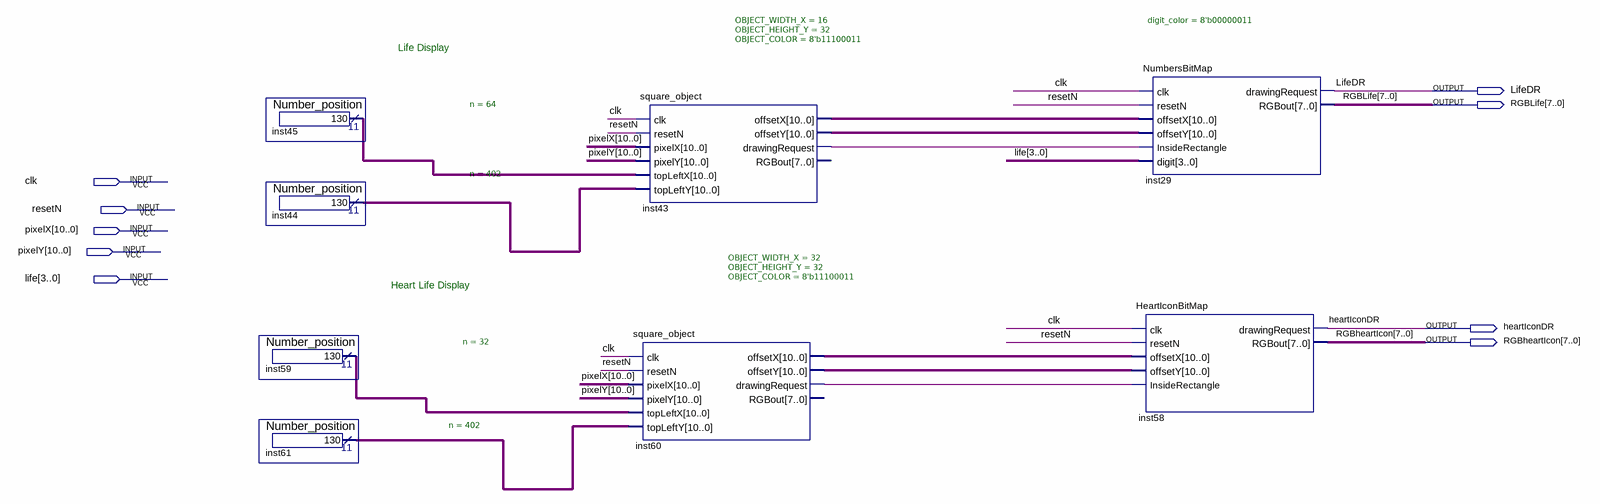
[diagram p0: schematic sheet]
// Quartus schematic Life_Block.bdf as structural Verilog: 8 symbols, 9 pins
module Life_Block (
  input  clk,
  input  resetN,
  input  [10:0] pixelX,
  input  [10:0] pixelY,
  input  [3:0] life,
  output LifeDR,
  output [7:0] RGBLife,
  output heartIconDR,
  output [7:0] RGBheartIcon
);

  wire inst43_drawingrequest, inst60_drawingrequest;
  wire [10:0] inst43_offsetx, inst43_offsety, inst44_result, inst45_result, inst59_result, inst60_offsetx,
       inst60_offsety, inst61_result;

  Number_position #(.n(64)) inst45 (.result(inst45_result));
  Number_position #(.n(402)) inst44 (.result(inst44_result));
  Number_position #(.n(32)) inst59 (.result(inst59_result));
  Number_position #(.n(402)) inst61 (.result(inst61_result));
  square_object #(.OBJECT_WIDTH_X(16), .OBJECT_HEIGHT_Y(32), .OBJECT_COLOR(8'b11100011)) inst43 (
    .clk(clk), .resetN(resetN), .pixelX(pixelX), .pixelY(pixelY), .topLeftX(inst45_result),
    .topLeftY(inst44_result), .offsetX(inst43_offsetx), .offsetY(inst43_offsety),
    .drawingRequest(inst43_drawingrequest));  // open: RGBout
  square_object #(.OBJECT_WIDTH_X(32), .OBJECT_HEIGHT_Y(32), .OBJECT_COLOR(8'b11100011)) inst60 (
    .clk(clk), .resetN(resetN), .pixelX(pixelX), .pixelY(pixelY), .topLeftX(inst59_result),
    .topLeftY(inst61_result), .offsetX(inst60_offsetx), .offsetY(inst60_offsety),
    .drawingRequest(inst60_drawingrequest));  // open: RGBout
  NumbersBitMap #(.digit_color(8'b00000011)) inst29 (
    .clk(clk), .resetN(resetN), .offsetX(inst43_offsetx), .offsetY(inst43_offsety),
    .InsideRectangle(inst43_drawingrequest), .digit(life), .drawingRequest(LifeDR), .RGBout(RGBLife));
  HeartIconBitMap inst58 (
    .clk(clk), .resetN(resetN), .offsetX(inst60_offsetx), .offsetY(inst60_offsety),
    .InsideRectangle(inst60_drawingrequest), .drawingRequest(heartIconDR), .RGBout(RGBheartIcon));

  // Notes on the sheet:
  //   Life Display
  //   Heart Life Display
endmodule
